# Altium schematic sheet Sheet1.SchDoc
size A4
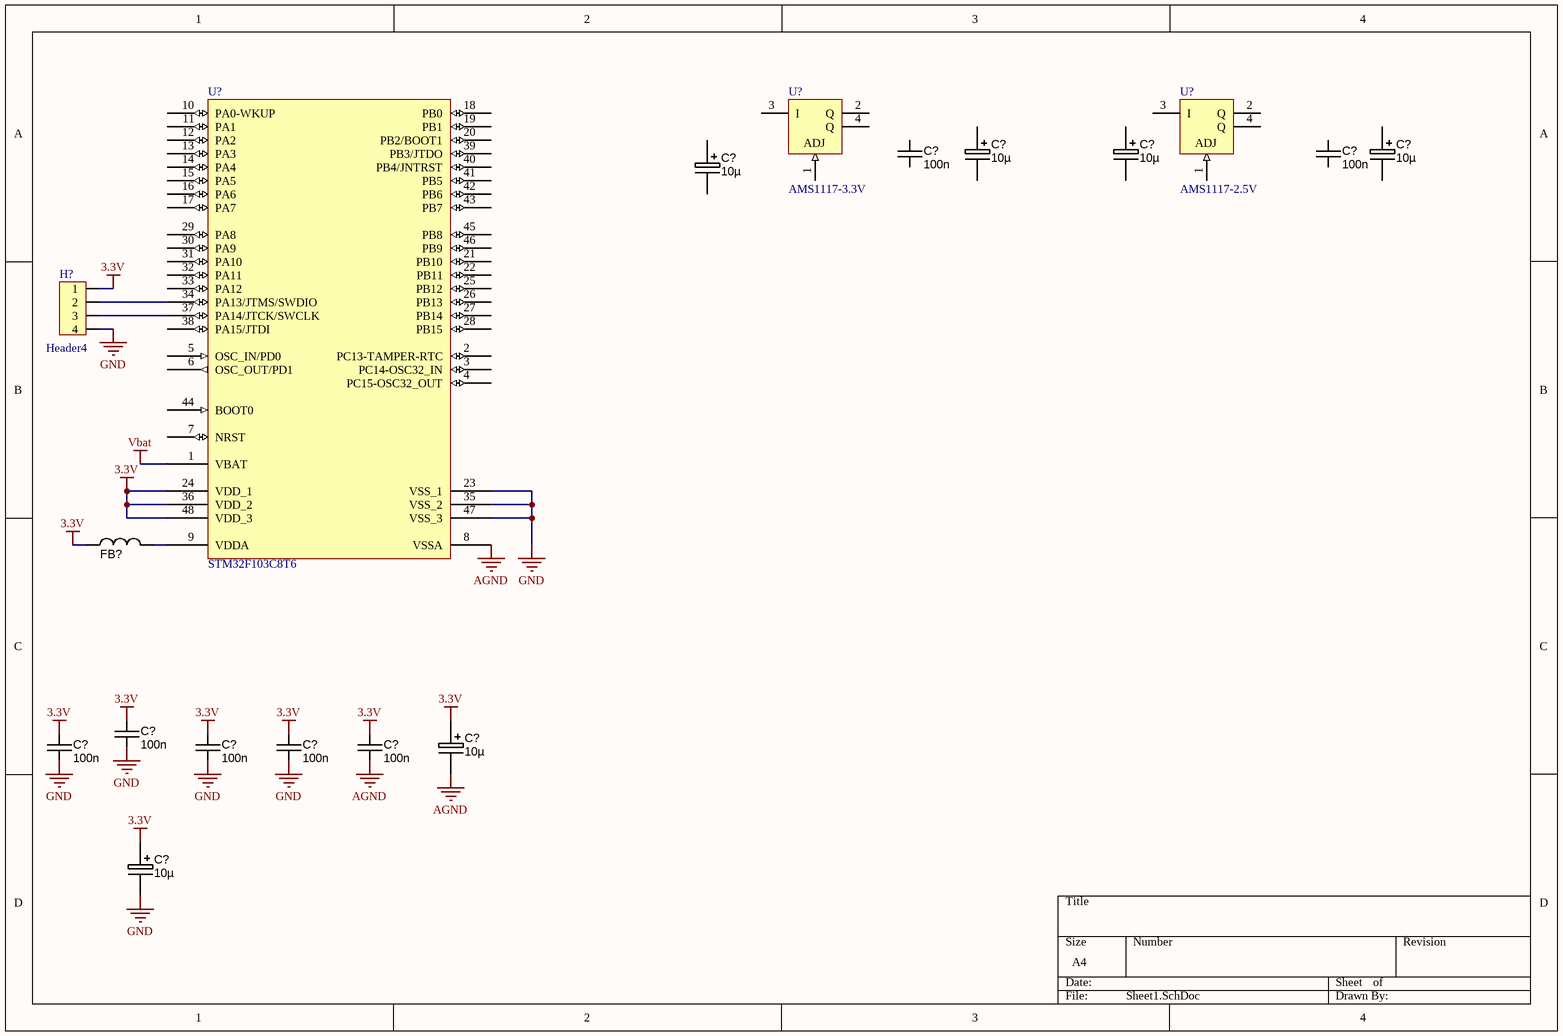
[diagram p0: Sheet1.SchDoc]

## Parts
(Parts that share a designator on the sheet are numbered #1, #2 ... from top to bottom, then left to right.)
C?#1  value 100n  [CAPC1608X90N]  (hidden comment: approved sub OK)
C?#2  10µ  [CAPMP6032X280N]
C?#3  10µ  [CAPMP6032X280N]
C?#4  value 100n  [CAPC1608X90N]  (hidden comment: approved sub OK)
C?#5  10µ  [CAPMP6032X280N]
C?#6  10µ  [CAPMP6032X280N]
C?#7  value 100n  [CAPC1608X90N]  (hidden comment: approved sub OK)
C?#8  value 100n  [CAPC1608X90N]  (hidden comment: approved sub OK)
C?#9  value 100n  [CAPC1608X90N]  (hidden comment: approved sub OK)
C?#10  value 100n  [CAPC1608X90N]  (hidden comment: approved sub OK)
C?#11  value 100n  [CAPC1608X90N]  (hidden comment: approved sub OK)
C?#12  10µ  [CAPMP6032X280N]
C?#13  10µ  [CAPMP6032X280N]
FB?  2K2 @ 100 MHz  [FBC2012N]  (value not drawn)
H?  Header4  [HDR4]
U?#1  STM32F103C8T6  [LQFP48_N]
U?#2  AMS1117-3.3V  [SOT223_N]
U?#3  AMS1117-2.5V  [SOT223_N]

## Nets
3.3V: C?#7.1 C?#8.1 C?#9.1 C?#10.1 C?#11.1 C?#12.1 C?#13.1 FB?.1 H?.1 U?#1.24(VDD_1) U?#1.36(VDD_2) U?#1.48(VDD_3)
AGND: C?#11.2 C?#12.2 U?#1.8(VSSA)
GND: C?#7.2 C?#8.2 C?#9.2 C?#10.2 C?#13.2 H?.4 U?#1.23(VSS_1) U?#1.35(VSS_2) U?#1.47(VSS_3)
Vbat: U?#1.1(VBAT)
NetFB?_2: FB?.2 U?#1.9(VDDA)
NetH?_2: H?.2 U?#1.34(PA13/JTMS/SWDIO)
NetH?_3: H?.3 U?#1.37(PA14/JTCK/SWCLK)

Not connected (* = marked no-connect by the designer): C?#1 1 2; C?#2 1 2; C?#3 1 2; C?#4 1 2; C?#5 1 2; C?#6 1 2; U?#1 2(PC13-TAMPER-RTC) 3(PC14-OSC32_IN) 4(PC15-OSC32_OUT) 5(OSC_IN/PD0) 6(OSC_OUT/PD1) 7(NRST) 10(PA0-WKUP) 11(PA1) 12(PA2) 13(PA3) 14(PA4) 15(PA5) 16(PA6) 17(PA7) 18(PB0) 19(PB1) 20(PB2/BOOT1) 21(PB10) 22(PB11) 25(PB12) 26(PB13) 27(PB14) 28(PB15) 29(PA8) 30(PA9) 31(PA10) 32(PA11) 33(PA12) 38(PA15/JTDI) 39(PB3/JTDO) 40(PB4/JNTRST) 41(PB5) 42(PB6) 43(PB7) 44(BOOT0) 45(PB8) 46(PB9); U?#2 1(ADJ) 2(Q) 3(I) 4(Q); U?#3 1(ADJ) 2(Q) 3(I) 4(Q)

## Library data of the parts
C?#1 C?#4 C?#7-C?#11 = CAPC_100n_0603_X7R_50V_10%: Capacitor SMD Cer 100nF 10% 50V X7R 0603; Manufacturer 1: AVX Corporation; Manufacturer Part Number 1: 06035C104KAT2A; Ratings: 50V; X7R; Material: ceramic; SCDType: spec; Manufacturer 2: TDK Corporation; Manufacturer Part Number 2: C1608X7R1H104K; Package / Case: 0603 (1608 Metric); Tolerance: ±10%; Supplier 1: Digi-Key; Supplier Part Number 1: 478-5052-1-ND; ComponentLink1URL: http://www.avx.com/docs/Catalogs/cx7r.pdf; ComponentLink1Description: http://www.avx.com/docs/Catalogs/cx7r.pdf; Supplier 2: Digi-Key; Supplier Part Number 2: 445-1314-1-ND; ComponentLink2URL: http://product.tdk.com/capacitor/mlcc/en/documents/mlcc_commercial_general_en.pdf; ComponentLink2Description: http://product.tdk.com/capacitor/mlcc/en/documents/mlcc_commercial_general_en.pdf
C?#2 C?#3 C?#5 C?#6 C?#12 C?#13 = CAPT_10u_6032_16V: Capacitor SMD Tantalum 10uF 20% 16V EIA 6032-28; Manufacturer 1: Vishay/Sprague; Manufacturer Part Number 1: 293D106X0016C2TE3; SCDType: undef; Package / Case: EIA 6032-28; Ratings: 16V; Tolerance: ±20%; Material: Tantalum; Supplier 1: Digi-Key; Supplier Part Number 1: 718-1042-1-ND; Value: 10µ
FB? = FERRITE_2K2-100MHz_0805: Ferrite bead 2.2K Ohm at 100 MHz 200mA 0805 SMD; Manufacturer 1: Laird-Signal Integrity Products; Manufacturer Part Number 1: HZ0805B222R-10; Ratings: 200 mA; 800 mOhm DC; Impedance @ Frequency: 600 Ohm @ 100MHz; DC Resistance (DCR): 800 mOhm Max; Filter Type: Differential Mode - Single; SCDType: source; Size / Dimension: 0.063" L x 0.031" W (1.60mm x 0.80mm); Current Rating: 200mA; Package / Case: 0805 (2012 Metric); Height (Max): 0.043" (1.09mm); ComponentLink1URL: http://www.lairdtech.com/WorkArea/linkit.aspx?LinkIdentifier=id&ItemID=4879; ComponentLink1Description: http://www.lairdtech.com/WorkArea/linkit.aspx?LinkIdentifier=id&ItemID=4879; Supplier 1: Digi-Key; Supplier Part Number 1: 240-2562-1-ND; Mounting Type: Surface Mount; Value: 2K2 @ 100 MHz
H? = Header4: Header IDC, 4 x 1 Pin Vertical 2.54mm Pitch (Non-Boxed, Male); Manufacturer: W¨¹rth Elektronik eiSos GmbH; partNo: 613002143121; ComponentLink1 Description: Manufacturer; ComponentLink2 Description: Datasheet; NoPins: 02; Created Date: 29 March 2013; ComponentLink1URL: http://www.we-online.com; ComponentLink2URL: http://katalog.we-online.de/em/datasheet/6130xx143121.pdf; Created by: Karrer Zheng
U?#1 = STM32F103C8T6: STM32 ARM-based 32-bit MCU with 64 Kbytes Flash, 48-pin LQFP, Industrial Temperature; Published: 30-May-2008; DatasheetVersion: rev6, Mar-2008; PackageVersion: Mar-2008; PackageReference: LQFP48; Publisher: Altium Limited; PackageDescription: 48-Pin Low-Profile Quad Flat Pack, 7 x 7 mm Body, 0.5 mm Pitch (LQFP48); ComponentLink1Description: Manufacturer Link; ComponentLink1URL: www.st.com/stm32; ComponentLink2Description: Datasheet; ComponentLink2URL: http://www.st.com/stonline/products/literature/ds/13587.pdf
U?#2 U?#3 = AMS1117: Voltage Regulator, 4.55 to 15 V Operating, 1000 mA, -40 to 125 degC, PG-SOT223 (SC-73), Reel, Green; Manufacturer: Infineon; PartNumber: IFX1117ME V; Accuracy: 2.0 %; Automotive Qualified: FALSE; Dropout Voltage: 1200 mV; Green: TRUE; Max Number Reflow: 3; Max Peak Reflow Temp: 260 degC; Max. Output Current: 1000 mA; Output Voltage: adj.; Regulator Type: Linear->single output; Typical Quiescent Current: 5000 uA; DatasheetVersion: Rev. 1.0; PackageVersion: Apr-08; PackageReference: PG-SOT223 (SC-73); PackageDescription: 4-Pin Small Outline Transistor Package, 6.5 x 3.5 mm Body, 2.3 mm Pitch; Supplier 1: Digi-Key; Supplier Part Number 1: IFX1117ME VINTR-ND; Supplier 2: Digi-Key; Supplier Part Number 2: IFX1117ME VINCT-ND; Supplier 3: Digi-Key; Supplier Part Number 3: IFX1117ME VINDKR-ND; Supplier 4: Mouser; Supplier Part Number 4: 726-IFX1117MEV; MSL: 1; Packing: Reel; Reset: FALSE; Status Output: FALSE; Mounting Technology: Surface Mount; ComponentLink1Description: Manufacturer URL; ComponentLink1URL: http://www.infineon.com/; ComponentLink2Description: Datasheet; ComponentLink2URL: http://www.infineon.com/dgdl/IFX1117ME+V33.pdf?folderId=db3a304318f3fe290118f5a433570040&fileId=db3a30432e779412012e9097d1611987; ComponentLink3Description: Package Specification; ComponentLink3URL: http://www.infineon.com/dgdl/SOT223-Package_Overview.pdf?folderId=db3a30431936bc4b0119530470b03c3d&fileId=db3a30431936bc4b0119531d40b93c5c